# EAGLE schematic Fuzz_pbc (EAGLE 9.6.2)
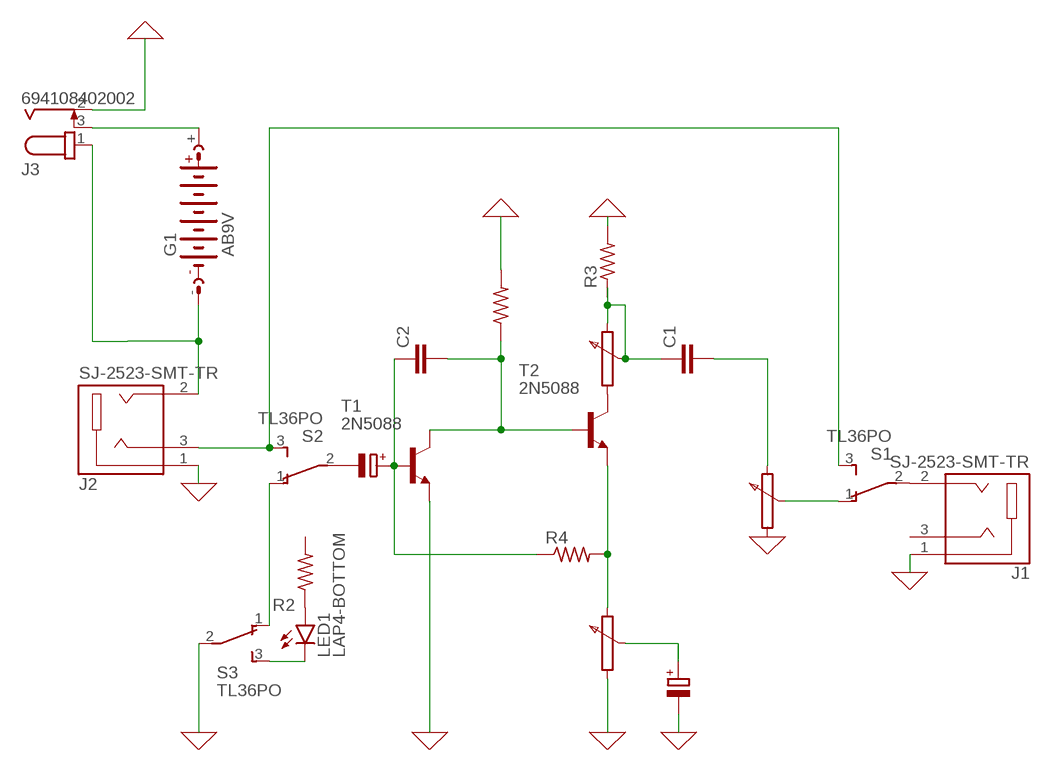
[diagram p0: schematic, sheet 1]

## Parts
C1  C2.5/2  [C2.5-2]
C2  C2.5/2  [C2.5-2]
G1  AB9V  [AB9V]
J1  SJ-2523-SMT-TR  [SJ-2523-SMT-TR]
J2  SJ-2523-SMT-TR  [SJ-2523-SMT-TR]
J3  694108402002  [694108402002]
LED1  LAP4-BOTTOM  [P47F-BOTTOM]
R1  R-US_0204/7  [0204/7]
R2  R-US_0204/7  [0204/7]
R3  R-US_0204/7  [0204/7]
R4  R-US_0204/7  [0204/7]
S1  TL36PO  [TL3XPO]
S2  TL36PO  [TL3XPO]
S3  TL36PO  [TL3XPO]
T1  2N5088  [TO92]
T2  2N5088  [TO92]

## Nets
0: J1.1(SLEEVE) J2.1(SLEEVE) J3.2 R1.2 R3.2 S3.2(P) T1.3(E) ; supply symbol labelled GND
N$1: C1.2
N$2: C2.2 R1.1 T1.1(C) T2.2(B)
N$3: J1.2(TIP) S1.2(P)
N$4: C1.1
N$5: S1.1(O)
N$6: C2.1 R4.1 T1.2(B)
N$7: G1.- J2.2(TIP) J3.1
N$8: J2.3(RING) S1.3(S) S2.3(S)
N$9: G1.+ J3.3
N$10: S2.1(O) S3.1(O)
N$11: LED1.C S3.3(S)
N$12: LED1.A R2.1
N$13: R4.2 T2.3(E)
Unconnected: J1.3(RING) R2.2 R3.1 S2.2(P) T2.1(C)

## Library data of the parts
C1 C2 = capacitor-wima:C: CAPACITOR naming: grid - package width
G1 = battery:AB9V: 9-V BATTERY CLIP
J1 J2 = Audio Connectors:SJ-2523-SMT-TR: CONN JACK STEREO 2.5MM SMD R/A Manufacturer's datasheet <https://www.cuidevices.com/product/resource/sj-252x-smt.pdf>; CREATED_BY: PCBLayout.com; DIGIKEY_PN: CP-2523SJTR-ND; MANUFACTURER: CUI Devices; MPN: SJ-2523-SMT-TR
J3 = DC Power Jacks:694108402002: CONN PWR JACK 2.5X5.5MM SOLDER Manufacturer's datasheet <https://katalog.we-online.de/em/datasheet/6941xx402002.pdf>; CREATED_BY: PCBLayout.com; DIGIKEY_PART_NUMBER: 732-5935-ND; MANUFACTURER: Wurth Electronics Inc.; MPN: 694108402002
LED1 = led:*P4: PointLED® Enhanced Thinfilm LED TOP & BOTTOM mount LS P47F, LR P47F, LA P47F, LY P47F, LT P4SG, LB P4SG, LW P4SG Source: http://catalog.osram-os.com .. LA_LR_LS_LY_P47F_Pb_free.pdf
R1-R4 = rcl:R-US_: RESISTOR, American symbol; SPICEPREFIX: R
S1-S3 = switch:TL36PO: TINY SWITCH ON - ON Source: http://www2.produktinfo.conrad.com/datenblaetter/700000-724999/705152-da-01-de-Subminiaturschalter_TL_36YO.pdf
T1 T2 = transistor:2N5088: NPN TRANSISTOR